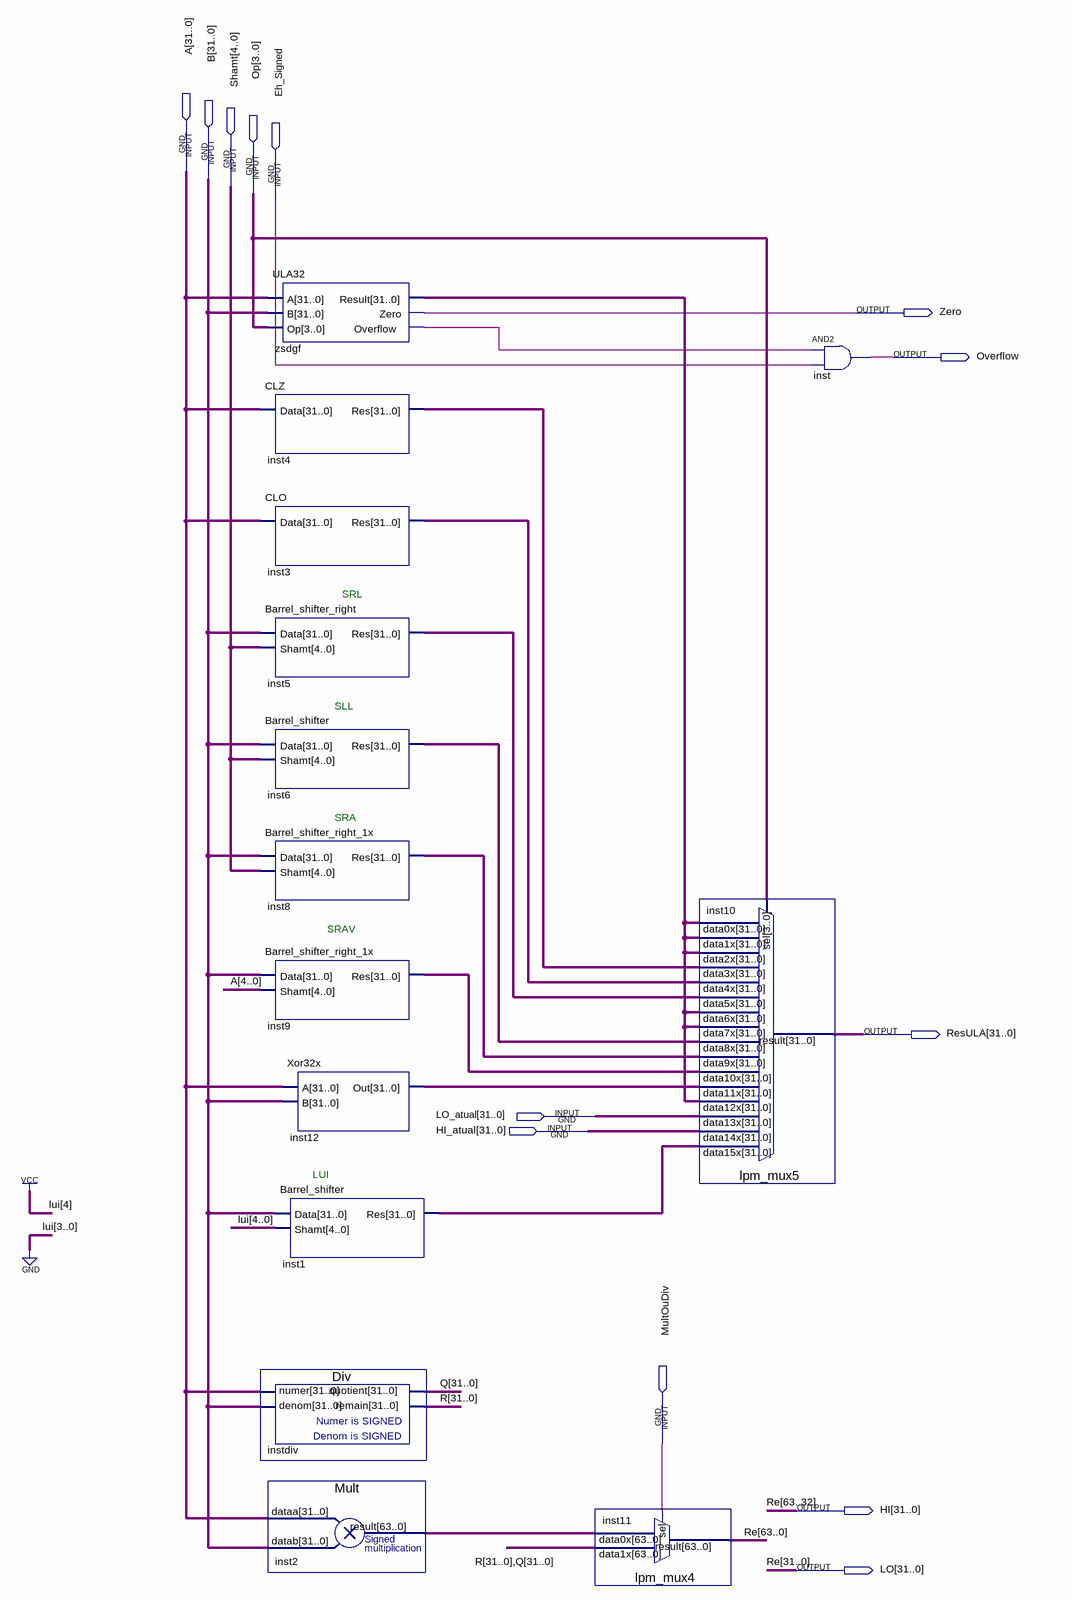
[diagram p0: schematic sheet]
// Quartus schematic ULONA.bdf as structural Verilog: 14 symbols, 13 pins
module ULONA (
  input  [31:0] A,
  input  [31:0] B,
  input  [4:0] Shamt,
  input  [3:0] Op,
  input  Eh_Signed,
  input  [31:0] LO_atual,
  input  [31:0] HI_atual,
  input  MultOuDiv,
  output Zero,
  output Overflow,
  output [31:0] ResULA,
  output [31:0] HI,
  output [31:0] LO
);

  wire zsdgf_overflow;
  wire [31:0] inst1_res, inst3_res, inst4_res, inst5_res, inst6_res, inst8_res, inst9_res, inst12_out, Q, R,
       zsdgf_result;
  wire [63:0] inst2_result;

  ULA32 zsdgf (.A(A), .B(B), .Op(Op), .Result(zsdgf_result), .Zero(Zero), .Overflow(zsdgf_overflow));
  CLZ inst4 (.Data(A), .Res(inst4_res));
  CLO inst3 (.Data(A), .Res(inst3_res));
  Barrel_shifter_right inst5 (.Data(B), .Shamt(Shamt), .Res(inst5_res));
  Barrel_shifter inst6 (.Data(B), .Shamt(Shamt), .Res(inst6_res));
  Barrel_shifter_right_1x inst8 (.Data(B), .Shamt(Shamt), .Res(inst8_res));
  Barrel_shifter_right_1x inst9 (.Data(B), .Shamt(A[4:0]), .Res(inst9_res));
  Div instdiv (.numer(A), .denom(B), .quotient(Q), .remain(R));
  Mult inst2 (.dataa(A), .datab(B), .result(inst2_result));
  Xor32x inst12 (.A(A), .B(B), .Out(inst12_out));
  Barrel_shifter inst1 (.Data(B), .Shamt(5'b10000), .Res(inst1_res));
  lpm_mux4 inst11 (.data1x({R, Q}), .data0x(inst2_result), .sel(MultOuDiv), .result({HI, LO}));
  lpm_mux5 inst10 (
    .data15x(inst1_res), .data14x(HI_atual), .data13x(LO_atual), .data12x(zsdgf_result),
    .data11x(inst12_out), .data10x(inst9_res), .data9x(inst8_res), .data8x(inst6_res), .data7x(zsdgf_result),
    .data6x(zsdgf_result), .data5x(inst5_res), .data4x(inst3_res), .data3x(inst4_res), .data2x(zsdgf_result),
    .data1x(zsdgf_result), .data0x(zsdgf_result), .sel(Op), .result(ResULA));
  and inst (Overflow, zsdgf_overflow, Eh_Signed);

  // Other names for the same wires on the sheet: Re[63:0] = {HI, LO}

  // Notes on the sheet:
  //   SRL
  //   SLL
  //   SRA
  //   SRAV
  //   LUI
endmodule
